# Altium schematic sheet thermal_monitor.SchDoc
size Letter; CompanyName: Carnegie Mellon University; Organization: Carnegie Mellon University; Address1: Carnegie Mellon University; Address2: Robotics Institute; Address3: 5000 Forbes Ave., 4208 NSH; Address4: Pittsburgh, PA 15213; DocumentNumber: 7; Revision: 1.0; SheetNumber: 7; SheetTotal: 8; PageSetup: Record=PageOptions|CenterHorizontal=True|CenterVertical=True|PrintScale=1.00|XCorrection=1.00|YCorrection=1.00|PrintKind=0|BorderSize=5000000|LeftOffset=0|BottomOffset=0|Orientation=2|PaperLength=1000|PaperWidth=1000|Scale=100|PaperSource=7|PrintQuality=-4|MediaType=1|DitherType=10|PaperKind=Letter|PrintScaleMode=1
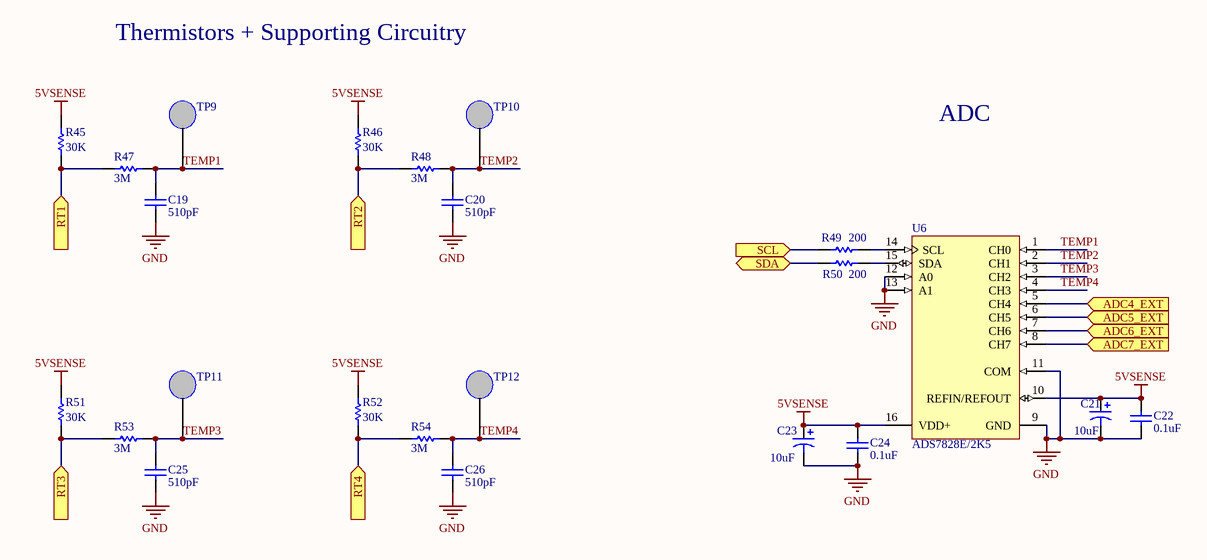
[diagram p0: thermal_monitor.SchDoc]

## Parts
C19  510pF  [CAPC1608N]
C20  510pF  [CAPC1608N]
C21  value 10uF  [CAPC2012N]  (hidden comment: Bypass Tanatalum, 5V, 10uF)
C22  value 0.1uF  [CAPC1608N]  (hidden comment: Bypass, 5V, 10nF)
C23  value 10uF  [CAPC2012N]  (hidden comment: Bypass Tantalum, 5V, 10uF)
C24  value 0.1uF  [CAPC1608N]  (hidden comment: Bypass, 5V, 10nF)
C25  510pF  [CAPC1608N]
C26  510pF  [CAPC1608N]
R45  value 30K  [RESC1608N]  (hidden comment: Therm_Rp, 30K)
R46  value 30K  [RESC1608N]  (hidden comment: Therm_Rp, 30K)
R47  3M  [RESC1608N]
R48  3M  [RESC1608N]
R49  200  [RESC1608N]
R50  200  [RESC1608N]
R51  value 30K  [RESC1608N]  (hidden comment: Therm_Rp, 30K)
R52  value 30K  [RESC1608N]  (hidden comment: Therm_Rp, 30K)
R53  3M  [RESC1608N]
R54  3M  [RESC1608N]
TP9  RT1  [TestPoint]  (value not drawn)
TP10  RT2  [TestPoint]  (value not drawn)
TP11  RT3  [TestPoint]  (value not drawn)
TP12  RT4  [TestPoint]  (value not drawn)
U6  ADS7828E/2K5  [TI-PW16_N]

## Ports
ADC4_EXT (in), ADC5_EXT (in), ADC6_EXT (in), ADC7_EXT (in), RT1 (in), RT2 (in), RT3 (in), RT4 (in), SCL (in), SDA (bidir)

## Nets
5VSENSE: C21.1 C22.2 C23.1 C24.2 R45.2 R46.2 R51.2 R52.2 U6.10(REFIN/REFOUT) U6.16(VDD+)
GND: C19.1 C20.1 C21.2 C22.1 C23.2 C24.1 C25.1 C26.1 U6.9(GND) U6.11(COM) U6.12(A0) U6.13(A1)
ADC4_EXT: U6.5(CH4) ; port ADC4_EXT
ADC5_EXT: U6.6(CH5) ; port ADC5_EXT
ADC6_EXT: U6.7(CH6) ; port ADC6_EXT
ADC7_EXT: U6.8(CH7) ; port ADC7_EXT
RT1: R45.1 R47.2 ; port RT1
RT2: R46.1 R48.2 ; port RT2
RT3: R51.1 R53.2 ; port RT3
RT4: R52.1 R54.2 ; port RT4
SCL: R49.1 ; port SCL
SDA: R50.1 ; port SDA
TEMP1: C19.2 R47.1 TP9.1 U6.1(CH0)
TEMP2: C20.2 R48.1 TP10.1 U6.2(CH1)
TEMP3: C25.2 R53.1 TP11.1 U6.3(CH2)
TEMP4: C26.2 R54.1 TP12.1 U6.4(CH3)
NetR49_2: R49.2 U6.14(SCL)
NetR50_2: R50.2 U6.15(SDA)

## Notes on the sheet
- Thermistors + Supporting Circuitry
- ADC
- Title
- Size:
- Date:
- Letter
- Number:
- Time:
- Revision:
- Sheet
- of
- File:

## Library data of the parts
C19 C20 C25 C26 = Cap: Capacitor; Manufacturer: Murata Electronics North America; Manufacturer Part Number: GRM1885C2A511JA01D; Description: CAP CER 510PF 100V NP0 0603; Tolerance: ±5%; Voltage - Rated: 100V; Temperature Coefficient: C0G, NP0; Published: 8-Jun-2000; LatestRevisionDate: 17-Jul-2002; LatestRevisionNote: Re-released for DXP Platform.; PackageReference: RAD-0.3; Publisher: Altium Limited; PackageDescription: Radial Cap, Thru-Hole; 2 Leads; 0.3 in Pin Spacing; Value: 510pF; Supplier 1: Digi-Key; Supplier Part Number 1: 490-1368-1-ND; RoHS: RoHS Compliant; Category: Capacitors; Stock 1: 12986; Pricing 1: 1=0.18, 10=0.122, 25=0.0916, 50=0.0702, 100=0.058, 250=0.0488, 500=0.04088, 1000=0.03355 (USD); Packaging: Cut Tape (CT); Capacitance: 510pF; Mounting Type: Surface Mount, MLCC; Operating Temperature: -55°C ~ 125°C; Applications: General Purpose; Ratings: -; Package / Case: 0603 (1608 Metric); Size / Dimension: 0.063" L x 0.031" W (1.60mm x 0.80mm); Height - Seated (Max): -; Thickness (Max): 0.035" (0.90mm); Lead Spacing: -; Features: -; Lead Style: -; ComponentLink1URL: http://www.murata.com/~/media/webrenewal/support/library/catalog/products/capacitor/mlcc/c02e.pdf; ComponentLink1Description: http://www.murata.com/~/media/webrenewal/support/library/catalog/products/capacitor/mlcc/c02e.pdf
C21 C23 = Cap Pol1: Polarized Capacitor (Radial); Manufacturer: AVX Corporation; Manufacturer Part Number: TACL106M010RTA; Manufacturer Size Code: L; Capacitance: 10µF; Tolerance: ±20%; Voltage - Rated: 10V; ESR (Equivalent Series Resistance): 7.5 Ohm; Type: Molded; Description: CAP TANT 10UF 6.3V 20% 0805; Published: 8-Jun-2000; LatestRevisionDate: 17-Jul-2002; LatestRevisionNote: Re-released for DXP Platform.; PackageReference: RB7.6-15; Publisher: Altium Limited; PackageDescription: Polarized Capacitor (Radial); 2 Leads; Supplier 1: Digi-Key; Supplier Part Number 1: 478-6230-1-ND; RoHS: RoHS Compliant; Category: Capacitors; Stock 1: 13074; Pricing 1: 1=2.24, 10=1.836, 100=1.2983, 250=1.07448, 500=0.96256, 1000=0.8954 (USD); Packaging: Cut Tape (CT); Operating Temperature: -55°C ~ 125°C; Mounting Type: Surface Mount; Package / Case: 0603 (1608 Metric); Size / Dimension: 0.063" L x 0.033" W (1.60mm x 0.85mm); Height - Seated (Max): 0.039" (1.00mm); Lead Spacing: -; Features: General Purpose; Lifetime @ Temp.: -; ComponentLink1URL: http://datasheets.avx.com/TAC.pdf; ComponentLink1Description: http://datasheets.avx.com/TAC.pdf; Supplier 2: Digi-Key; Supplier Part Number 2: 478-8115-1-ND; Stock 2: 38138; Pricing 2: 1=0.37, 10=0.312, 100=0.156, 250=0.117, 500=0.10336, 1000=0.09165 (USD); ComponentLink2URL: http://datasheets.avx.com/f92.pdf; ComponentLink2Description: http://datasheets.avx.com/f92.pdf
C22 C24 = Cap: Capacitor; Manufacturer: Murata Electronics North America; Manufacturer Part Number: GRM188R71H104JA93D; Description: CAP CER 0.1UF 50V X7R 0603; Capacitance: 0.10µF; Tolerance: ±5%; Voltage - Rated: 50V; Temperature Coefficient: X7R; Published: 8-Jun-2000; LatestRevisionDate: 17-Jul-2002; LatestRevisionNote: Re-released for DXP Platform.; PackageReference: RAD-0.3; Publisher: Altium Limited; PackageDescription: Radial Cap, Thru-Hole; 2 Leads; 0.3 in Pin Spacing; Supplier 1: Digi-Key; Supplier Part Number 1: 490-13406-1-ND; RoHS: RoHS Compliant; Category: Capacitors; Stock 1: 7465; Pricing 1: 1=0.11, 10=0.078, 50=0.0422, 100=0.0358, 250=0.02924, 500=0.02502, 1000=0.0195 (USD); Packaging: Cut Tape (CT); Mounting Type: Surface Mount, MLCC; Operating Temperature: -55°C ~ 125°C; Applications: General Purpose; Ratings: -; Package / Case: 0603 (1608 Metric); Size / Dimension: 0.063" L x 0.031" W (1.60mm x 0.80mm); Height - Seated (Max): -; Thickness (Max): 0.031" (0.80mm); Lead Spacing: -; Features: -; Lead Style: -; ComponentLink1URL: http://www.murata.com/~/media/webrenewal/support/library/catalog/products/capacitor/mlcc/c02e.pdf; ComponentLink1Description: http://www.murata.com/~/media/webrenewal/support/library/catalog/products/capacitor/mlcc/c02e.pdf
R45 R46 R51 R52 = Res1: Resistor; Manufacturer: Yageo; Manufacturer Part Number: RT0603DRD0730KL; Description: RES SMD 30K OHM 0.5% 1/10W 0603; Tolerance: ±0.5%; Power (Watts): 0.1W, 1/10W; Temperature Coefficient: ±25ppm/°C; Published: 8-Jun-2000; LatestRevisionDate: 17-Jul-2002; LatestRevisionNote: Re-released for DXP Platform.; PackageReference: AXIAL-0.3; Publisher: Altium Limited; PackageDescription: Axial Device, Thru-Hole; 2 Leads; 0.3 in Pin Spacing; Supplier 1: Digi-Key; Supplier Part Number 1: 311-30KDCT-ND; RoHS: RoHS Compliant; Category: Resistors; Stock 1: 26965; Pricing 1: 1=0.22, 10=0.184, 25=0.134, 100=0.0721, 250=0.05532, 500=0.04358, 1000=0.03018, 2500=0.02766 (USD); Packaging: Cut Tape (CT); Resistance (Ohms): 30k; Composition: Thin Film; Features: Moisture Resistant; Operating Temperature: -55°C ~ 155°C; Package / Case: 0603 (1608 Metric); Supplier Device Package: 0603; Size / Dimension: 0.063" L x 0.031" W (1.60mm x 0.80mm); Height: 0.022" (0.55mm); Number of Terminations: 2; ComponentLink1URL: http://www.yageo.com/documents/recent/PYu-RT_1-to-0.05_RoHS_L_6.pdf; ComponentLink1Description: http://www.yageo.com/documents/recent/PYu-RT_1-to-0.05_RoHS_L_6.pdf
R47 R48 R53 R54 = Res1: Resistor; Manufacturer: Yageo; Manufacturer Part Number: RC0603JR-073ML; Description: RES SMD 3M OHM 5% 1/10W 0603; Tolerance: ±5%; Power (Watts): 0.1W, 1/10W; Temperature Coefficient: ±100ppm/°C; Published: 8-Jun-2000; LatestRevisionDate: 17-Jul-2002; LatestRevisionNote: Re-released for DXP Platform.; PackageReference: AXIAL-0.3; Publisher: Altium Limited; PackageDescription: Axial Device, Thru-Hole; 2 Leads; 0.3 in Pin Spacing; Value: 3M; Supplier 1: Digi-Key; Supplier Part Number 1: 311-3.0MGRCT-ND; RoHS: RoHS Compliant; Category: Resistors; Stock 1: 60830; Pricing 1: 1=0.1, 10=0.011, 25=0.008, 100=0.0044, 250=0.00336, 500=0.0027, 1000=0.00198, 2500=0.00172 (USD); Packaging: Cut Tape (CT); Resistance (Ohms): 3M; Composition: Thick Film; Features: Moisture Resistant; Operating Temperature: -55°C ~ 155°C; Package / Case: 0603 (1608 Metric); Supplier Device Package: 0603; Size / Dimension: 0.063" L x 0.031" W (1.60mm x 0.80mm); Height: 0.022" (0.55mm); Number of Terminations: 2; ComponentLink1URL: http://www.yageo.com/documents/recent/PYu-RC_Group_51_RoHS_L_04.pdf; ComponentLink1Description: http://www.yageo.com/documents/recent/PYu-RC_Group_51_RoHS_L_04.pdf
R49 R50 = Res1: Resistor; Manufacturer: Yageo; Manufacturer Part Number: RC0603JR-07200RL; Description: RES SMD 200 OHM 5% 1/10W 0603; Tolerance: ±5%; Power (Watts): 0.1W, 1/10W; Temperature Coefficient: ±100ppm/°C; Published: 8-Jun-2000; LatestRevisionDate: 17-Jul-2002; LatestRevisionNote: Re-released for DXP Platform.; PackageReference: AXIAL-0.3; Publisher: Altium Limited; PackageDescription: Axial Device, Thru-Hole; 2 Leads; 0.3 in Pin Spacing; Value: 200; Supplier 1: Digi-Key; Supplier Part Number 1: 311-200GRCT-ND; RoHS: RoHS Compliant; Category: Resistors; Stock 1: 267996; Pricing 1: 1=0.1, 10=0.011, 25=0.008, 100=0.0044, 250=0.00336, 500=0.0027, 1000=0.00198, 2500=0.00172 (USD); Packaging: Cut Tape (CT); Resistance (Ohms): 200; Composition: Thick Film; Features: Moisture Resistant; Operating Temperature: -55°C ~ 155°C; Package / Case: 0603 (1608 Metric); Supplier Device Package: 0603; Size / Dimension: 0.063" L x 0.031" W (1.60mm x 0.80mm); Height: 0.022" (0.55mm); Number of Terminations: 2; ComponentLink1URL: http://www.yageo.com/documents/recent/PYu-RC_Group_51_RoHS_L_04.pdf; ComponentLink1Description: http://www.yageo.com/documents/recent/PYu-RC_Group_51_RoHS_L_04.pdf
TP9-TP12 = Ring_Terminal: Test Point
U6 = ADS7828E/2K5: 12-Bit 50 kSPS ADC I2C Low Power 8-Channel Multiplexer Internal 2.5 V Reference, -40 to 85 degC, 16-pin SOP (PW16), Green (RoHS & no Sb/Br); Manufacturer: Texas Instruments; Description: IC ADC 12BIT 50KSPS 8CH 16-TSSOP; Number of Bits: 12; Sampling Rate (Per Second): 50k; Number of Inputs: 8; Input Type: Differential, Single Ended; Data Interface: I²C; Configuration: MUX-S/H-ADC; Ratio - S/H:ADC: 1:1; Number of A/D Converters: 1; Architecture: SAR; Reference Type: External, Internal; Voltage - Supply, Analog: 2.7 V ~ 3.6 V, 5V; Supplier 1: Digi-Key; Supplier Part Number 1: 296-38856-1-ND; Manufacturer Part Number: ADS7828E/2K5; RoHS: RoHS Compliant By Exemption; Category: Integrated Circuits (ICs); Stock 1: 3104; Pricing 1: 1=7.39, 10=6.693, 100=5.5175, 500=4.824, 1000=3.76875 (USD); Packaging: Cut Tape (CT); Voltage - Supply, Digital: 2.7 V ~ 3.6 V, 5V; Features: -; Operating Temperature: -40°C ~ 85°C; Package / Case: 16-TSSOP (0.173", 4.40mm Width); Supplier Device Package: 16-TSSOP; ComponentLink1URL: http://www.ti.com/lit/ds/symlink/ads7828.pdf; ComponentLink1Description: http://www.ti.com/lit/ds/symlink/ads7828.pdf